# Altium schematic sheet eth.SchDoc
size A
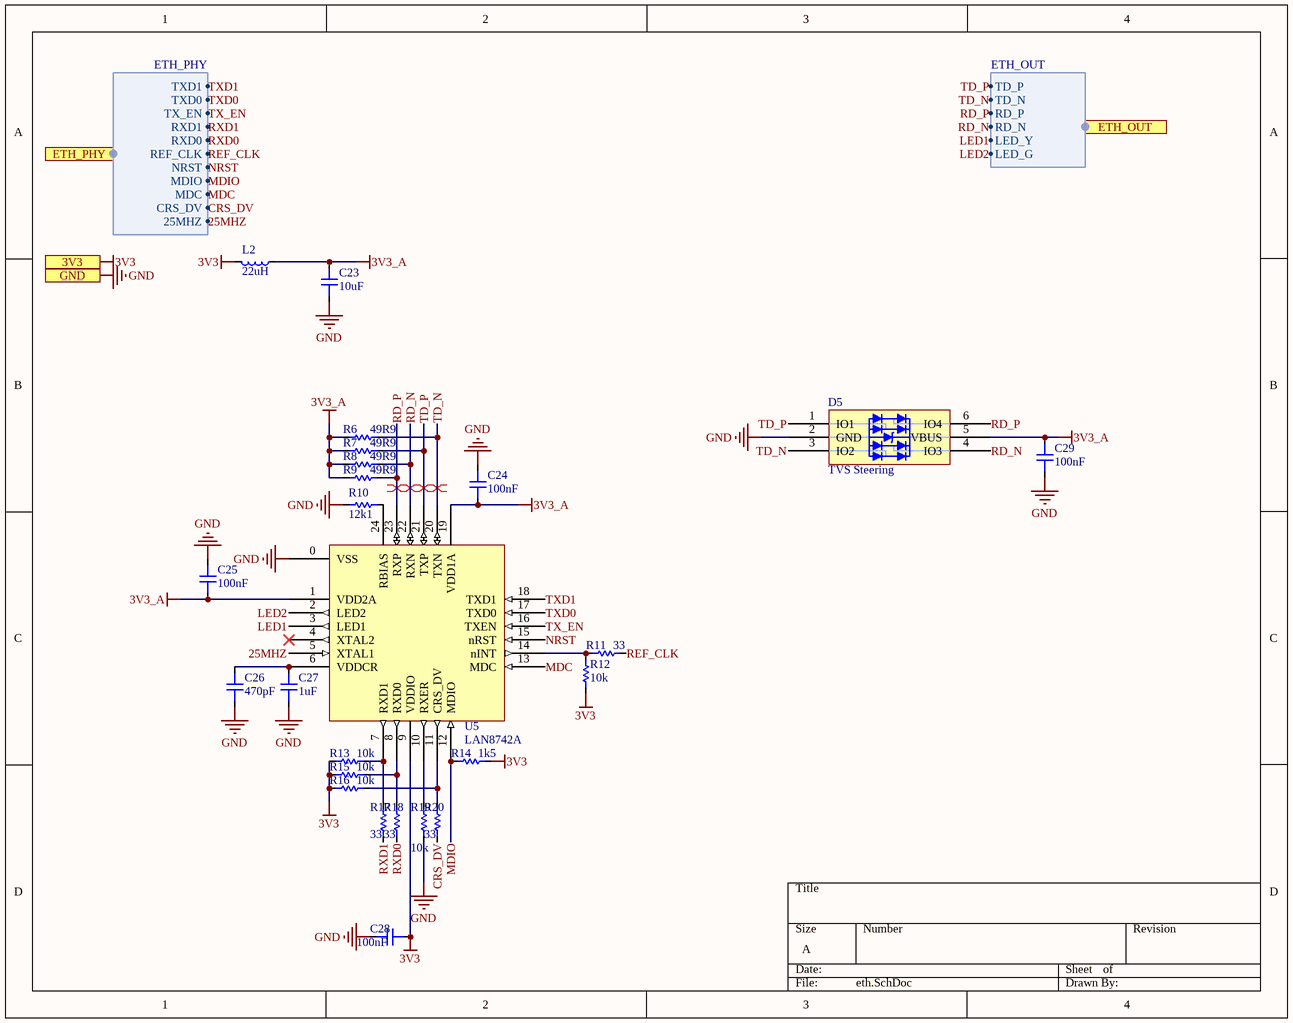
[diagram p0: eth.SchDoc]

## Parts
C23  10uF  [CAP 0805 L]
C24  100nF  [CAP 0805 L]
C25  100nF  [CAP 0805 L]
C26  470pF  [CAP 0805 L]
C27  1uF  [CAP 0805 L]
C28  100nF  [CAP 0805 L]
C29  100nF  [CAP 0805 L]
D5  TVS Steering  [SC-74]
L2  22uH  [IND 0805 L]
R6  49R9  [RES 0603 L]
R7  49R9  [RES 0603 L]
R8  49R9  [RES 0603 L]
R9  49R9  [RES 0603 L]
R10  12k1  [RES 0603 L]
R11  33  [RES 0603 L]
R12  10k  [RES 0603 L]
R13  10k  [RES 0603 L]
R14  1k5  [RES 0603 L]
R15  10k  [RES 0603 L]
R16  10k  [RES 0603 L]
R17  33  [RES 0603 L]
R18  33  [RES 0603 L]
R19  10k  [RES 0603 L]
R20  33  [RES 0603 L]
U5  LAN8742A  [VQFN24]

## Ports
3V3, ETH_OUT (harness ETH_OUT), ETH_PHY (harness ETH_PHY), GND

## Harnesses
ETH_PHY: 25MHZ, CRS_DV, MDC, MDIO, NRST, REF_CLK, RXD0, RXD1, TX_EN, TXD0, TXD1
ETH_OUT: TD_P, TD_N, RD_P, RD_N, LED_Y, LED_G

## Nets
3V3: C28.2 L2.2 R12.2 R13.2 R14.1 R15.2 R16.2 U5.9(VDDIO) ; port 3V3
3V3_A: C23.2 C24.1 C25.1 C29.2 D5.5(VBUS) L2.1 R6.2 R7.2 R8.2 R9.2 U5.1(VDD2A) U5.19(VDD1A)
GND: C23.1 C24.2 C25.2 C26.1 C27.1 C28.1 C29.1 D5.2(GND) R10.1 R19.1 U5.0(VSS) ; port GND
25MHZ: U5.5(XTAL1) ; port ETH_PHY.25MHZ
CRS_DV: R20.1 ; port ETH_PHY.CRS_DV
LED1: U5.3(LED1) ; port ETH_OUT.LED_Y
LED2: U5.2(LED2) ; port ETH_OUT.LED_G
MDC: U5.13(MDC) ; port ETH_PHY.MDC
MDIO: R14.2 U5.12(MDIO) ; port ETH_PHY.MDIO
NRST: U5.15(nRST) ; port ETH_PHY.NRST
RD_N: D5.4(IO3) R8.1 U5.22(RXN) ; port ETH_OUT.RD_N
RD_P: D5.6(IO4) R9.1 U5.23(RXP) ; port ETH_OUT.RD_P
REF_CLK: R11.1 ; port ETH_PHY.REF_CLK
RXD0: R18.1 ; port ETH_PHY.RXD0
RXD1: R17.1 ; port ETH_PHY.RXD1
TD_N: D5.3(IO2) R6.1 U5.20(TXN) ; port ETH_OUT.TD_N
TD_P: D5.1(IO1) R7.1 U5.21(TXP) ; port ETH_OUT.TD_P
TX_EN: U5.16(TXEN) ; port ETH_PHY.TX_EN
TXD0: U5.17(TXD0) ; port ETH_PHY.TXD0
TXD1: U5.18(TXD1) ; port ETH_PHY.TXD1
NetC26_2: C26.2 C27.2 U5.6(VDDCR)
NetR10_2: R10.2 U5.24(RBIAS)
NetR11_2: R11.2 R12.1 U5.14(nINT)
NetR13_1: R13.1 R17.2 U5.7(RXD1)
NetR15_1: R15.1 R18.2 U5.8(RXD0)
NetR16_1: R16.1 R20.2 U5.11(CRS_DV)
NetR19_2: R19.2 U5.10(RXER)

Not connected (* = marked no-connect by the designer): U5 4(XTAL2)*

## Layout directives
differential pair: RD_N, RD_P, TD_N, TD_P

## Library data of the parts
C23-C29 = CAP 0805
D5 = DTVS 2Rail 4x: CM1293A-04SO; Supplier 1: Digi-Key; Supplier Part Number 1: CM1293A-04SOOSCT-ND
L2 = IND 0805
R6-R20 = RES 0603
U5 = IC ETH PHY RMII: LAN8742A-CZ-TR / LAN8742AI-CZ-TR